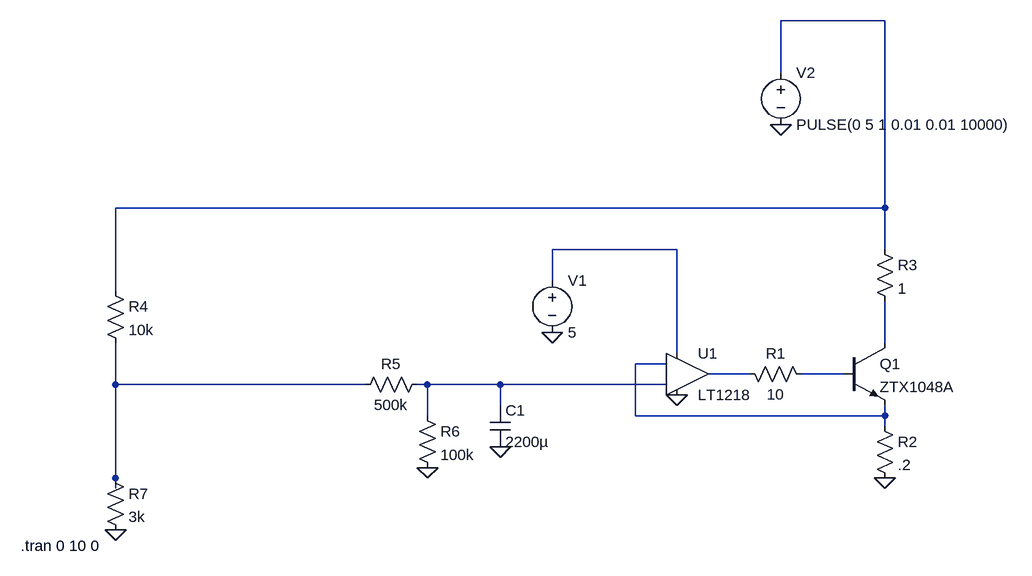
[diagram p0: schematic Draft5.asc]
Draft5.asc, the LTspice schematic file:
Version 4
SHEET 1 1368 680
WIRE 1152 -384 992 -384
WIRE 992 -304 992 -384
WIRE 1152 -96 1152 -384
WIRE 1152 -96 -32 -96
WIRE 832 -32 640 -32
WIRE 1152 -32 1152 -96
WIRE 640 16 640 -32
WIRE -32 32 -32 -96
WIRE 1152 112 1152 48
WIRE 832 128 832 -32
WIRE 816 144 768 144
WIRE 944 160 880 160
WIRE 1088 160 1024 160
WIRE -32 176 -32 112
WIRE 352 176 -32 176
WIRE 448 176 432 176
WIRE 560 176 448 176
WIRE 816 176 560 176
WIRE 560 208 560 176
WIRE 448 224 448 176
WIRE 768 224 768 144
WIRE 1152 224 1152 208
WIRE 1152 224 768 224
WIRE 1152 240 1152 224
WIRE -32 320 -32 176
WIRE -32 336 -32 320
FLAG 832 192 0
FLAG 1152 320 0
FLAG 640 96 0
FLAG -32 400 0
FLAG 560 272 0
FLAG 448 304 0
FLAG 992 -224 0
SYMBOL npn 1088 112 R0
SYMATTR InstName Q1
SYMATTR Value ZTX1048A
SYMBOL res 928 144 M90
WINDOW 0 0 56 VBottom 2
WINDOW 3 32 56 VTop 2
SYMATTR InstName R1
SYMATTR Value 10
SYMBOL res 1136 224 R0
SYMATTR InstName R2
SYMATTR Value .2
SYMBOL voltage 640 0 R0
WINDOW 123 0 0 Left 0
WINDOW 39 0 0 Left 0
SYMATTR InstName V1
SYMATTR Value 5
SYMBOL res 1136 -48 R0
SYMATTR InstName R3
SYMATTR Value 1
SYMBOL res 448 160 R90
WINDOW 0 0 56 VBottom 2
WINDOW 3 32 56 VTop 2
SYMATTR InstName R5
SYMATTR Value 500k
SYMBOL cap 544 208 R0
SYMATTR InstName C1
SYMATTR Value 2200µ
SYMBOL res 432 208 R0
SYMATTR InstName R6
SYMATTR Value 100k
SYMBOL res -48 16 R0
SYMATTR InstName R4
SYMATTR Value 10k
SYMBOL res -48 304 R0
SYMATTR InstName R7
SYMATTR Value 3k
SYMBOL voltage 992 -320 R0
WINDOW 123 0 0 Left 0
WINDOW 39 0 0 Left 0
SYMATTR InstName V2
SYMATTR Value PULSE(0 5 1 0.01 0.01 10000)
SYMBOL Opamps\\LT1218 848 160 R0
SYMATTR InstName U1
TEXT -178 424 Left 2 !.tran 0 10 0

The netlist it stands for:
* Draft5.asc
Q1 N003 N006 N004 0 ZTX1048A
R1 N005 N006 10
R2 N004 0 .2
V1 N002 0 5
R3 N001 N003 1
R5 N008 N007 500k
C1 N008 0 2200µ
R6 N008 0 100k
R4 N001 N007 10k
R7 N007 0 3k
V2 N001 0 PULSE(0 5 1 0.01 0.01 10000)
XU1 N008 N004 N002 0 N005 NC_01 LT1218
.model NPN NPN
.model PNP PNP
.lib standard.bjt
.tran 0 10 0
.lib LTC.lib
.backanno
.end